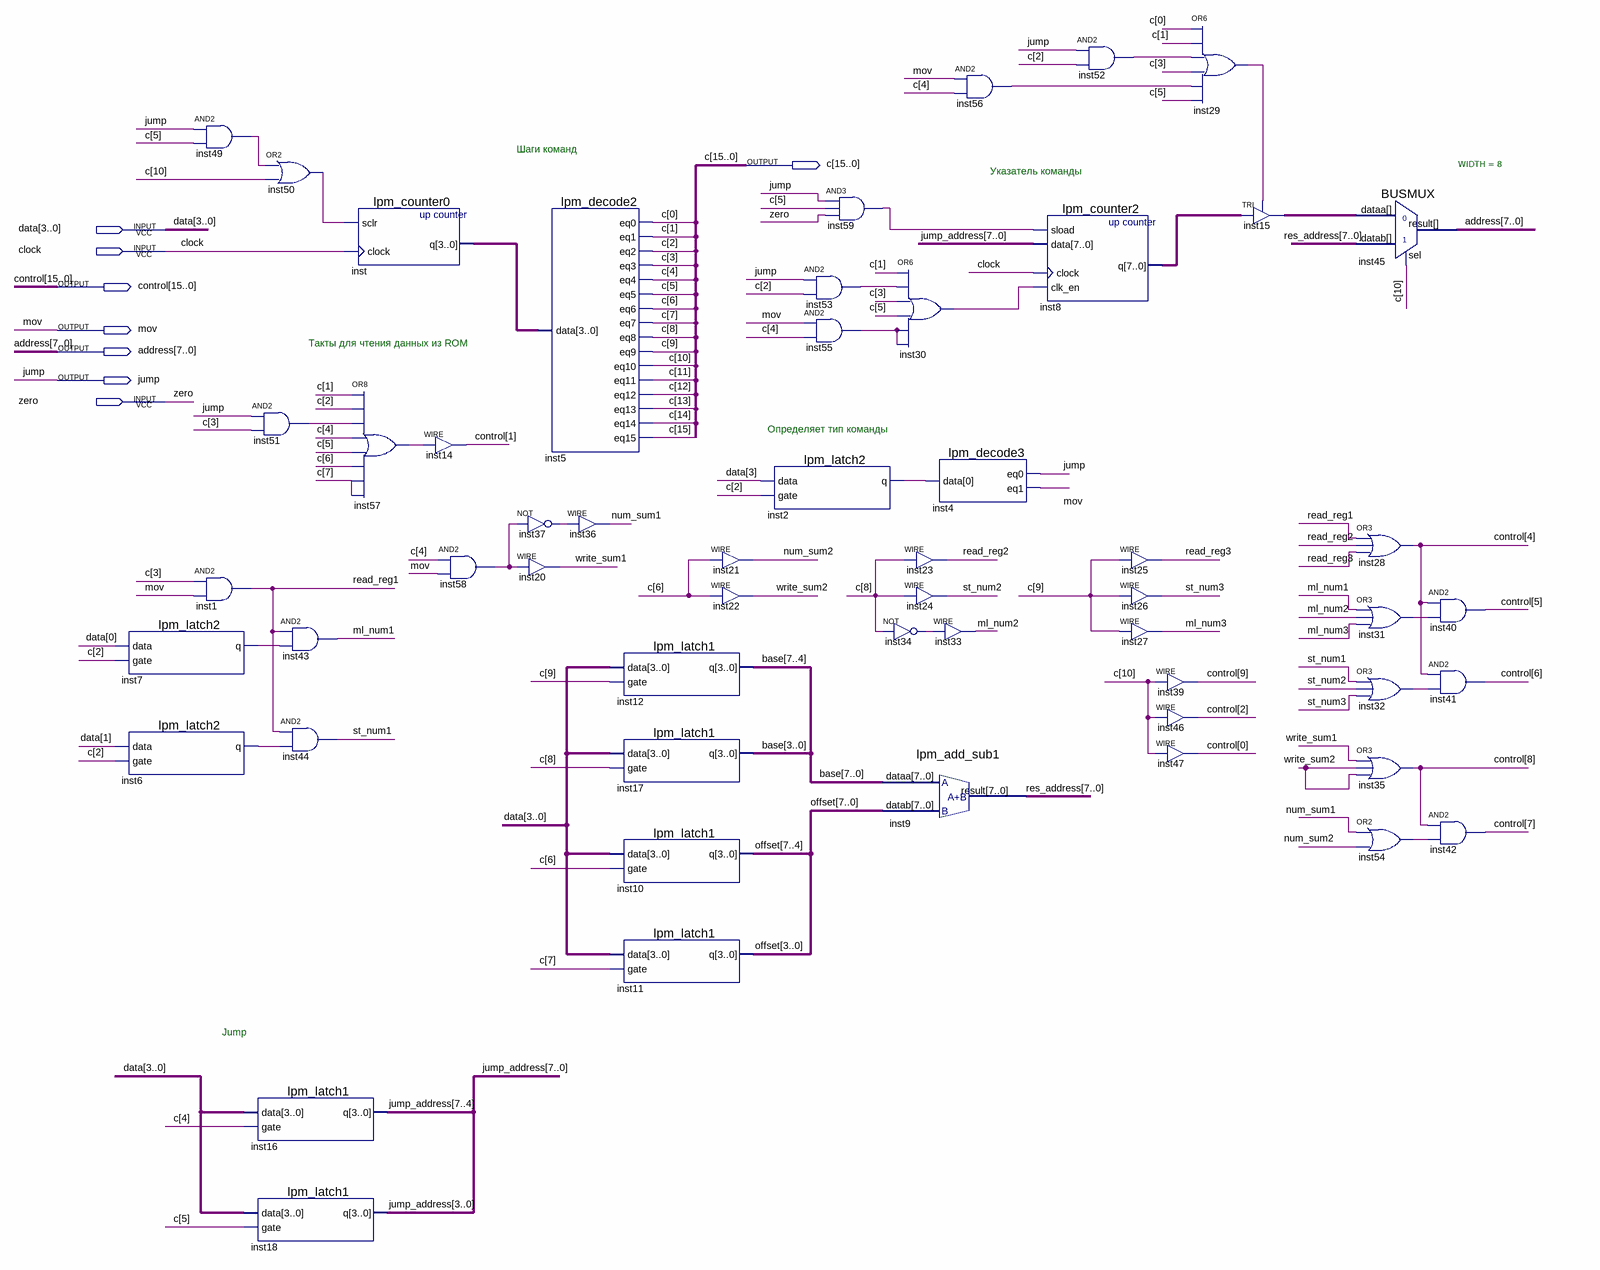
[diagram p0: schematic sheet]
// Quartus schematic control.bdf as structural Verilog: 55 symbols, 8 pins
module control (
  input  [3:0] data,
  input  clock,
  input  zero,
  output [15:0] c,
  output [15:0] control,
  output mov,
  output [7:0] address,
  output jump
);

  wire inst2_q, inst6_q, inst7_q, inst29_out, inst30_out, inst31_out, inst32_out, inst34_out, inst37_out,
       inst49_out, inst50_out, inst51_out, inst52_out, inst53_out, inst54_out, inst55_out, inst56_out,
       inst57_out, inst58_out, inst59_out, ml_num1, ml_num2, ml_num3, num_sum1, num_sum2, read_reg1,
       read_reg2, read_reg3, st_num1, st_num2, st_num3, write_sum1, write_sum2;
  wire [3:0] inst_q;
  wire [7:0] base, inst8_q, inst15_out, jump_address, offset, res_address;

  lpm_latch2 inst7 (.data(data[0]), .gate(c[2]), .q(inst7_q));
  lpm_latch2 inst6 (.data(data[1]), .gate(c[2]), .q(inst6_q));
  and inst49 (inst49_out, jump, c[5]);
  and inst1 (read_reg1, c[3], mov);
  and inst51 (inst51_out, jump, c[3]);
  lpm_latch1 inst16 (.data(data), .gate(c[4]), .q(jump_address[7:4]));
  lpm_latch1 inst18 (.data(data), .gate(c[5]), .q(jump_address[3:0]));
  or inst50 (inst50_out, inst49_out, c[10]);
  and inst43 (ml_num1, read_reg1, inst7_q);
  and inst44 (st_num1, read_reg1, inst6_q);
  lpm_counter0 inst (.sclr(inst50_out), .clock(clock), .q(inst_q));
  or inst57 (inst57_out, c[1], c[2], inst51_out, c[4], c[5], c[6], c[7], c[7]);
  assign control[1] = inst57_out;  // WIRE inst14
  and inst58 (inst58_out, c[4], mov);
  lpm_decode2 inst5 (
    .data(inst_q), .eq0(c[0]), .eq1(c[1]), .eq2(c[2]), .eq3(c[3]), .eq4(c[4]), .eq5(c[5]), .eq6(c[6]),
    .eq7(c[7]), .eq8(c[8]), .eq9(c[9]), .eq10(c[10]), .eq11(c[11]), .eq12(c[12]), .eq13(c[13]), .eq14(c[14]),
    .eq15(c[15]));
  not inst37 (inst37_out, inst58_out);
  assign write_sum1 = inst58_out;  // WIRE inst20
  assign num_sum1 = inst37_out;  // WIRE inst36
  lpm_latch1 inst12 (.data(data), .gate(c[9]), .q(base[7:4]));
  lpm_latch1 inst17 (.data(data), .gate(c[8]), .q(base[3:0]));
  lpm_latch1 inst10 (.data(data), .gate(c[6]), .q(offset[7:4]));
  lpm_latch1 inst11 (.data(data), .gate(c[7]), .q(offset[3:0]));
  assign num_sum2 = c[6];  // WIRE inst21
  assign write_sum2 = c[6];  // WIRE inst22
  lpm_latch2 inst2 (.data(data[3]), .gate(c[2]), .q(inst2_q));
  and inst59 (inst59_out, jump, c[5], zero);
  and inst53 (inst53_out, jump, c[2]);
  and inst55 (inst55_out, mov, c[4]);
  not inst34 (inst34_out, c[8]);
  lpm_add_sub1 inst9 (.dataa(base), .datab(offset), .result(res_address));
  or inst30 (inst30_out, c[1], inst53_out, c[3], c[5], inst55_out, inst55_out);
  lpm_decode3 inst4 (.data(inst2_q), .eq0(jump), .eq1(mov));
  assign read_reg2 = c[8];  // WIRE inst23
  assign st_num2 = c[8];  // WIRE inst24
  assign ml_num2 = inst34_out;  // WIRE inst33
  and inst56 (inst56_out, mov, c[4]);
  lpm_counter2 inst8 (.sload(inst59_out), .data(jump_address), .clock(clock), .clk_en(inst30_out), .q(inst8_q));
  and inst52 (inst52_out, jump, c[2]);
  assign read_reg3 = c[9];  // WIRE inst25
  assign st_num3 = c[9];  // WIRE inst26
  assign ml_num3 = c[9];  // WIRE inst27
  assign control[9] = c[10];  // WIRE inst39
  assign control[2] = c[10];  // WIRE inst46
  assign control[0] = c[10];  // WIRE inst47
  or inst29 (inst29_out, c[0], c[1], inst52_out, c[3], inst56_out, c[5]);
  TRI inst15[7:0] (.IN(inst8_q), .OE(inst29_out), .OUT(inst15_out));
  BUSMUX #(.WIDTH(8)) inst45 (.datab(res_address), .sel(c[10]), .dataa(inst15_out), .result(address));
  or inst28 (control[4], read_reg1, read_reg2, read_reg3);
  or inst31 (inst31_out, ml_num1, ml_num2, ml_num3);
  or inst32 (inst32_out, st_num1, st_num2, st_num3);
  or inst35 (control[8], write_sum1, write_sum2, write_sum2);
  or inst54 (inst54_out, num_sum1, num_sum2);
  and inst40 (control[5], control[4], inst31_out);
  and inst41 (control[6], control[4], inst32_out);
  and inst42 (control[7], control[8], inst54_out);

  // Notes on the sheet:
  //   Шаги команд
  //   Указатель команды
  //   Такты для чтения данных из ROM
  //   Определяет тип команды
  //   Jump
endmodule
